# EAGLE design STM32F4 TFT-Proto Adapter FSMC (EAGLE 6.4)
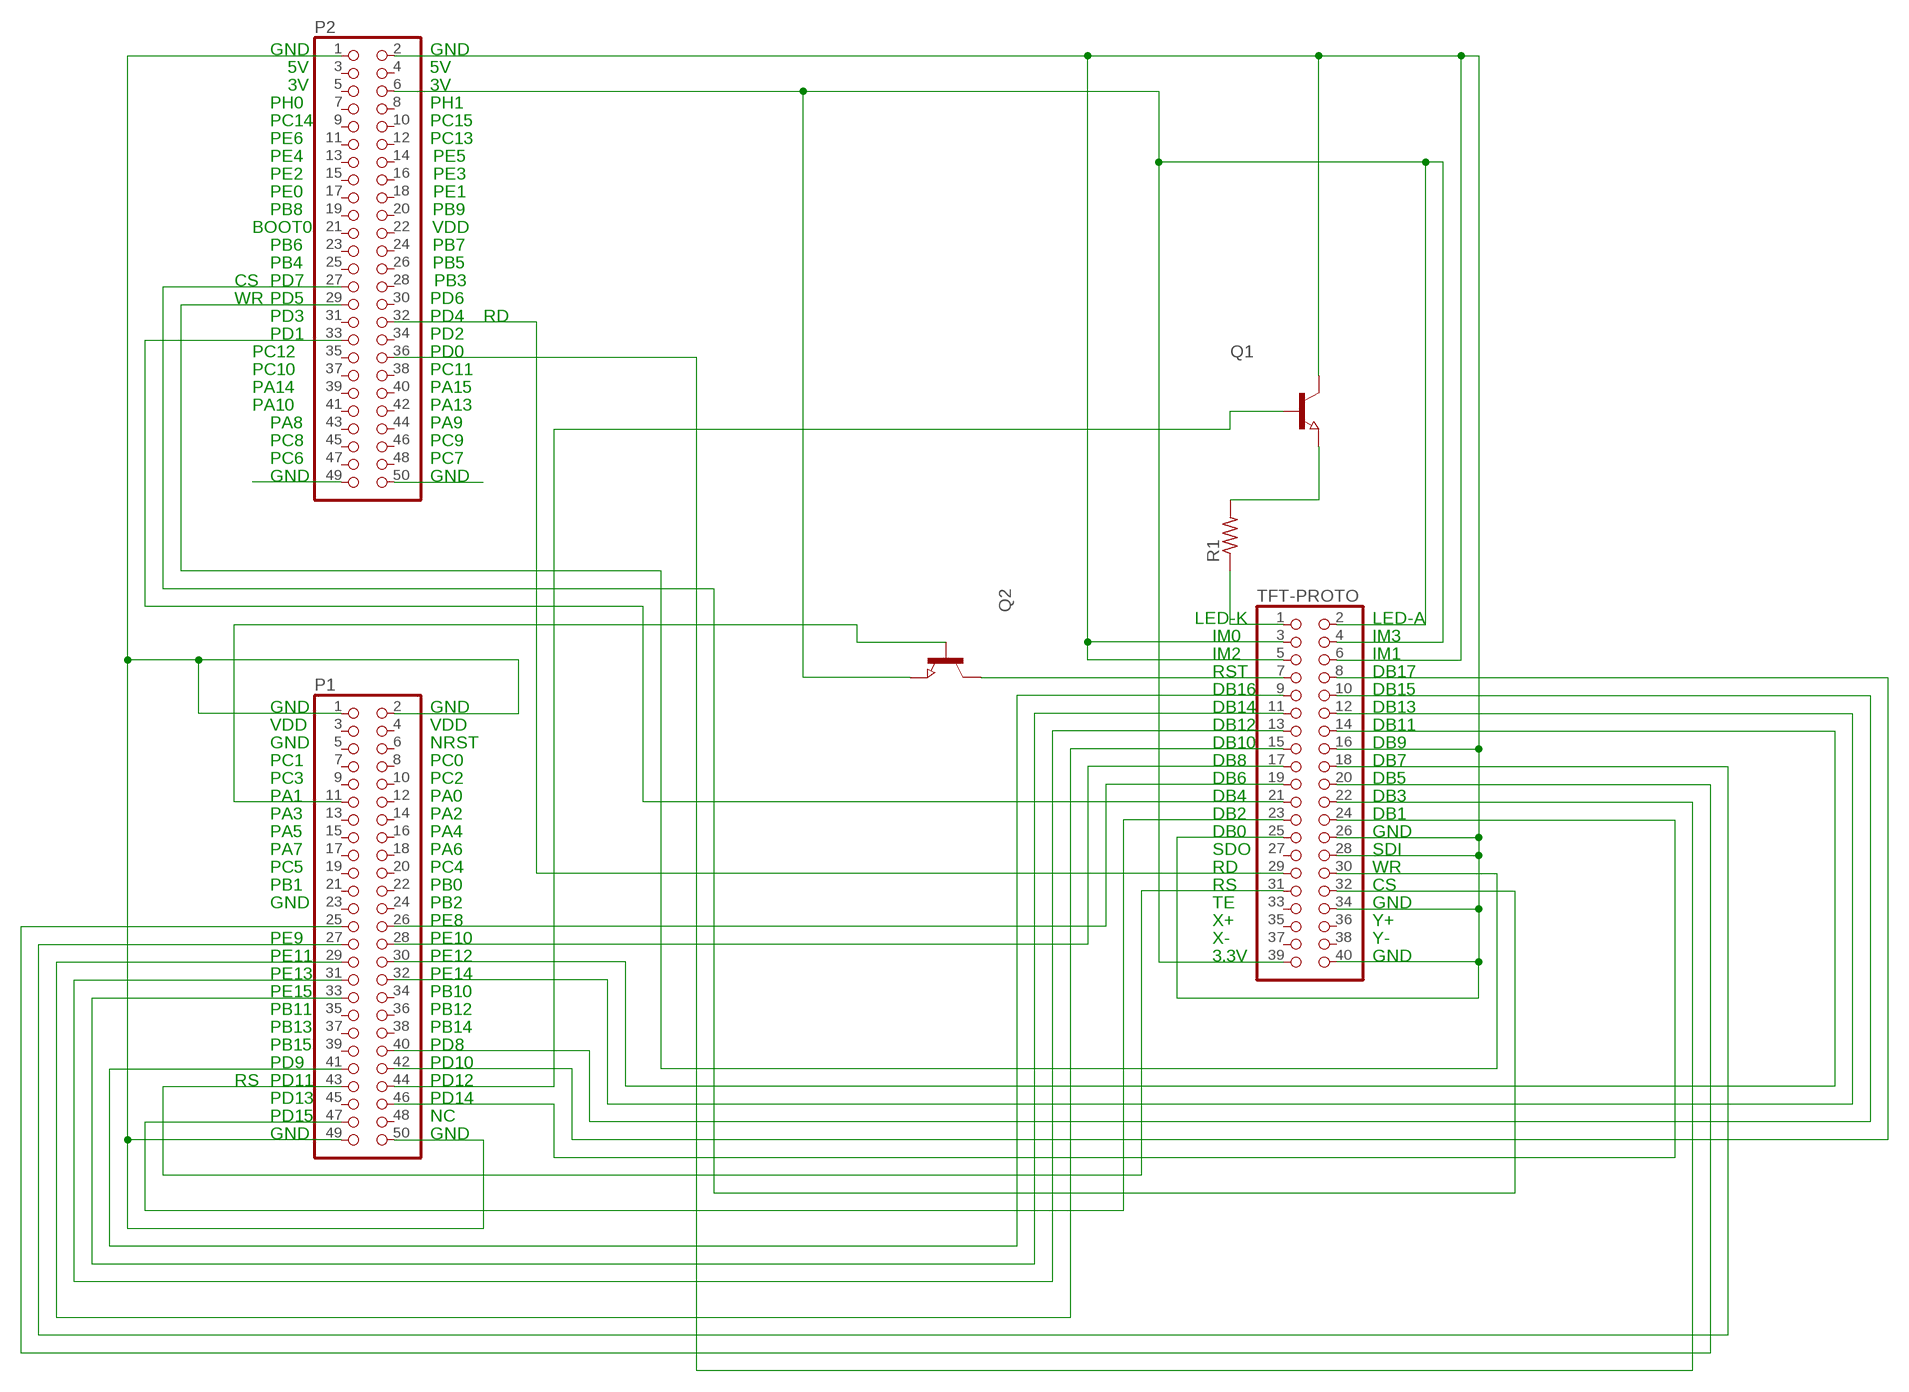
[diagram p0: schematic, sheet 1]

## Parts
P1  PINHD-2X25  [2X25]
P2  PINHD-2X25  [2X25]
Q1  NPN-TRANSISTOR_SOT23  [SOT23]
Q2  NPN-TRANSISTOR_SOT23  [SOT23]
R1  R-US_R0805  [R0805]
TFT-PROTO  PINHD-2X20  [2X20]

## Nets
CS: P2.27 TFT-PROTO.32
DB1: P1.46 TFT-PROTO.24
DB2: P1.47 TFT-PROTO.23
DB3: P2.36 TFT-PROTO.22
DB4: P2.33 TFT-PROTO.21
DB5: P1.25 TFT-PROTO.20
DB6: P1.26 TFT-PROTO.19
DB7: P1.27 TFT-PROTO.18
DB8: P1.28 TFT-PROTO.17
DB10: P1.29 TFT-PROTO.15
DB11: P1.30 TFT-PROTO.14
DB12: P1.31 TFT-PROTO.13
DB13: P1.32 TFT-PROTO.12
DB14: P1.33 TFT-PROTO.11
DB15: P1.40 TFT-PROTO.10
DB16: P1.41 TFT-PROTO.9
DB17: P1.42 TFT-PROTO.8
GND: P1.1 P1.2 P1.49 P1.50 P2.1 P2.2 P2.49 P2.50 Q1.3(C) TFT-PROTO.3 TFT-PROTO.5 TFT-PROTO.6 TFT-PROTO.16 TFT-PROTO.25 TFT-PROTO.26 TFT-PROTO.28 TFT-PROTO.34 TFT-PROTO.40
N$1: P1.44 Q1.1(B)
N$2: Q1.2(E) R1.2
N$3: R1.1 TFT-PROTO.1
N$4: Q2.3(C) TFT-PROTO.7
PWR: P2.6 Q2.2(E) TFT-PROTO.2 TFT-PROTO.4 TFT-PROTO.39
RD: P2.32 TFT-PROTO.29
RS: P1.43 TFT-PROTO.31
RST: P1.11 Q2.1(B)
WR: P2.29 TFT-PROTO.30
Unconnected: P1.3 P1.4 P1.5 P1.6 P1.7 P1.8 P1.9 P1.10 P1.12 P1.13 P1.14 P1.15 P1.16 P1.17 P1.18 P1.19 P1.20 P1.21 P1.22 P1.23 P1.24 P1.34 P1.35 P1.36 P1.37 P1.38 P1.39 P1.45 P1.48 P2.3 P2.4 P2.5 P2.7 P2.8 P2.9 P2.10 P2.11 P2.12 P2.13 P2.14 P2.15 P2.16 P2.17 P2.18 P2.19 P2.20 P2.21 P2.22 P2.23 P2.24 P2.25 P2.26 P2.28 P2.30 P2.31 P2.34 P2.35 P2.37 P2.38 P2.39 P2.40 P2.41 P2.42 P2.43 P2.44 P2.45 P2.46 P2.47 P2.48 TFT-PROTO.27 TFT-PROTO.33 TFT-PROTO.35 TFT-PROTO.36 TFT-PROTO.37 TFT-PROTO.38

## Notes on the sheet
- GND | GND
- 5V | 5V
- 3V | 3V
- PH0 | PH1
- PC14 | PC15
- PE6 | PC13
- PE4                          PE5
- PE2                          PE3
- PE0                          PE1
- PB8                          PB9
- BOOT0                        VDD
- PB6                          PB7
- PB4                          PB5
- CS | PD7                          PB3
- WR | PD5 | PD6
- PD3 | PD4 | RD
- PD1 | PD2
- PC12 | PD0
- PC10 | PC11
- PA14 | PA15
- PA10 | PA13
- PA8 | PA9
- PC8 | PC9
- PC6 | PC7
- GND | GND
- LED-K | LED-A
- IM0 | IM3
- IM2 | IM1
- RST | DB17
- DB16 | DB15
- GND | GND | DB14 | DB13
- VDD | VDD | DB12 | DB11
- GND | NRST | DB10 | DB9
- PC1 | PC0 | DB8 | DB7
- PC3 | PC2 | DB6 | DB5
- PA1 | PA0 | DB4 | DB3
- PA3 | PA2 | DB2 | DB1
- PA5 | PA4 | DB0 | GND
- PA7 | PA6 | SDO | SDI
- PC5 | PC4 | RD | WR
- PB1 | PB0 | RS | CS
- GND | PB2 | TE | GND
- PE7 | PE8 | X+ | Y+
- PE9 | PE10 | X- | Y-
- PE11 | PE12 | 3.3V | GND
- PE13 | PE14
- PE15 | PB10
- PB11 | PB12
- PB13 | PB14
- PB15 | PD8
- PD9 | PD10
- RS | PD11 | PD12
- PD13 | PD14
- PD15 | NC
- GND | GND

## Library data of the parts
P1 P2 = pinhead:PINHD-2X25: PIN HEADER
Q1 Q2 = semicon-smd-ipc:NPN-TRANSISTOR_: NPN TRANSISTOR
R1 = resistor:R-US_: RESISTOR, American symbol
TFT-PROTO = pinhead:PINHD-2X20: PIN HEADER

## Board
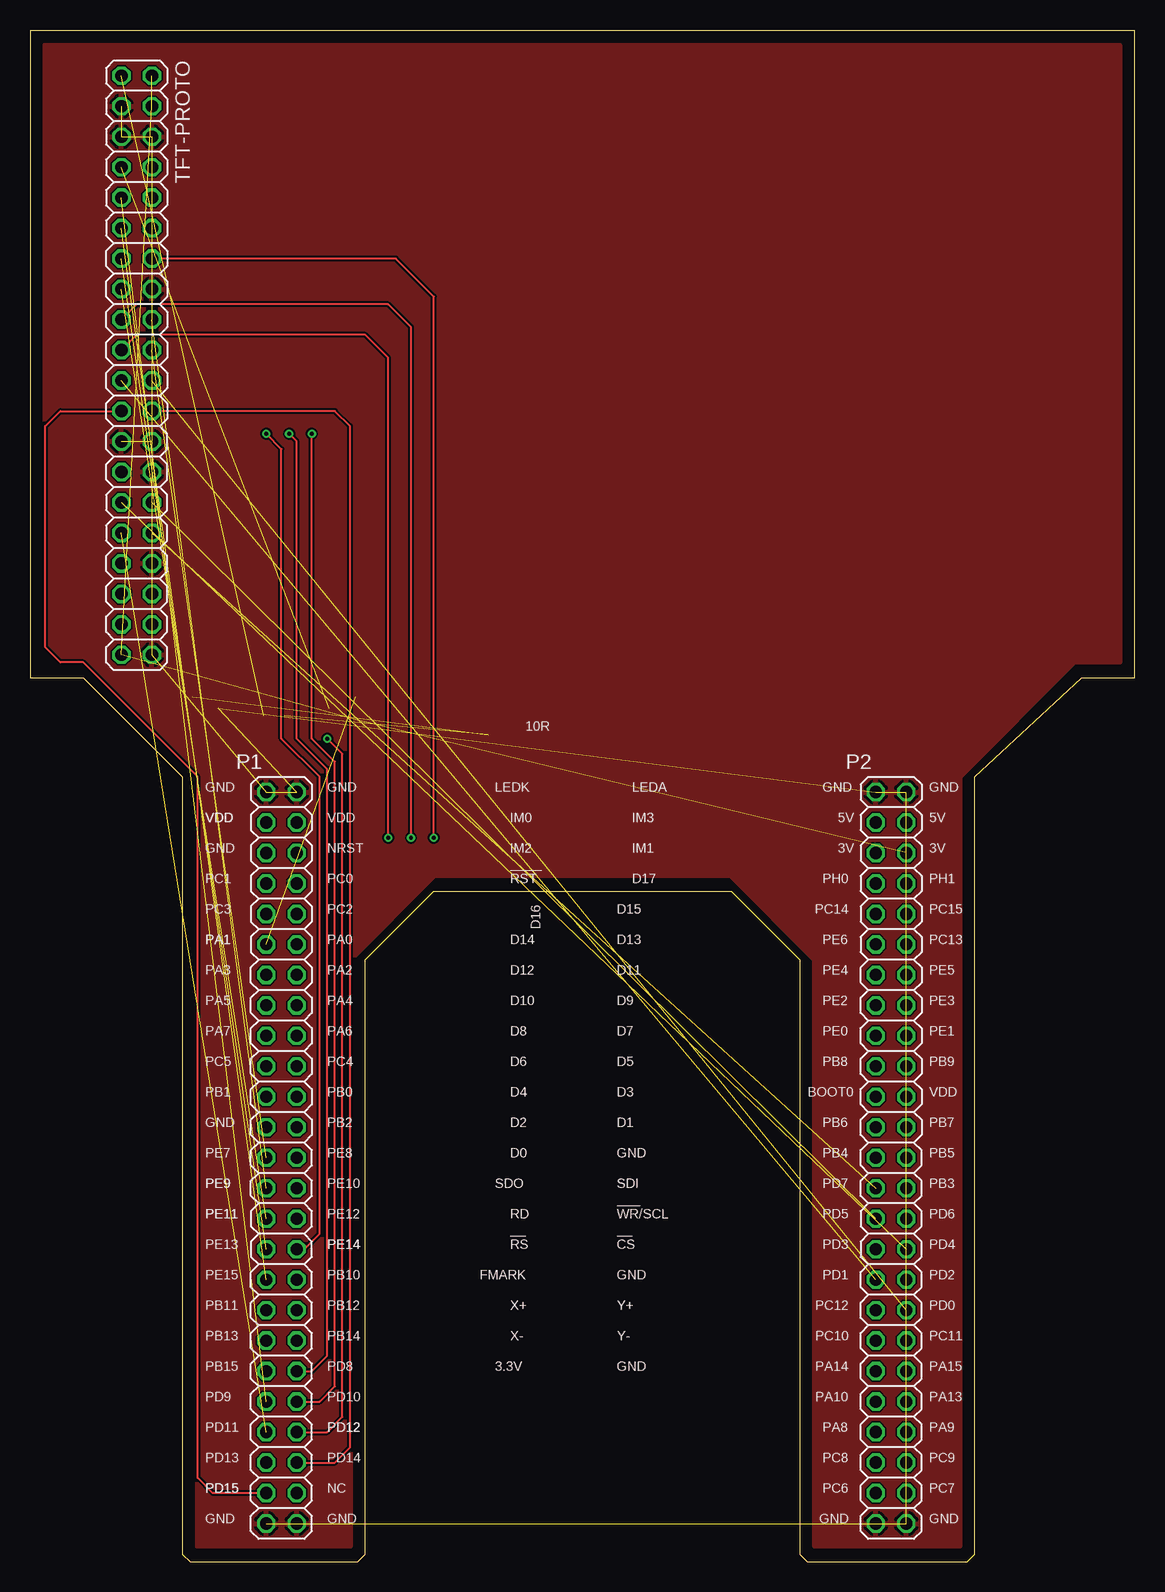
[diagram p1: board, top side]
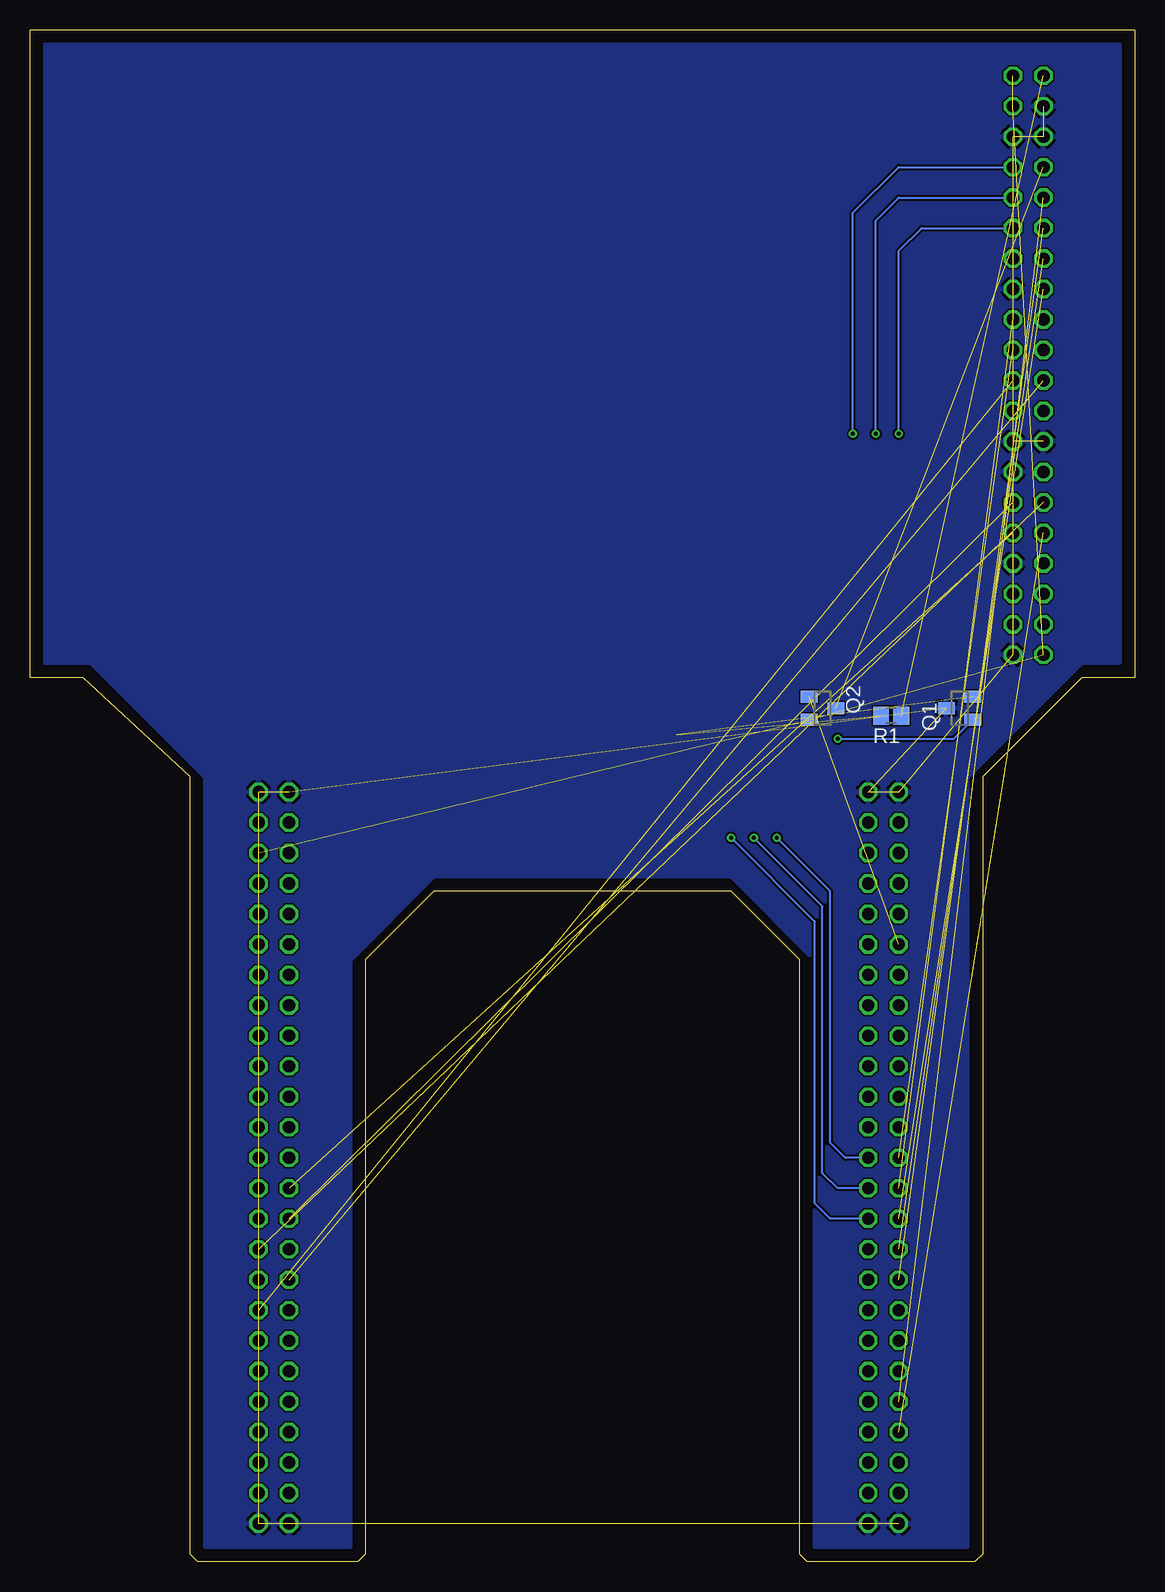
[diagram p2: board, bottom side, seen from below]

Size 92.08 x 127.64 mm. Coordinates in mm from the lower left corner, seen from the top.
Outline: 0,127.64 92.08,127.64 92.08,73.66 87.63,73.66 78.74,65.41 78.74,0.64 78.11,0 64.77,0 64.14,0.64 64.14,50.16 58.42,55.88 33.66,55.88 27.94,50.16 27.94,0.64 27.3,0 13.33,0 12.7,0.64 12.7,65.41 4.45,73.66 0,73.66 0,127.64
Copper layers (1*16): Top 0.0356mm / dielectric 1.5011mm / Bottom 0.0356mm
Design rules "LaenPCBOrder *": minimum track width 6mil, minimum drill 13mil, track to track 6mil, track to pad 6mil, pad to pad 6mil, via to via 6mil, smd to smd 6mil, copper to edge 15mil, drill to drill 6mil, minimum pad ring 7mil, minimum via ring 7mil, stop-mask expansion 4mil, vias tented up to drill 25mil, thermal gap 10mil

### Footprints (pad centres in the part's own frame; a part is rotated, then mirrored left to right if it is on the bottom)
2X25 = drill 1.016 octagon: 1 -30.48,-1.27; 2 -30.48,1.27; 3 -27.94,-1.27; 4 -27.94,1.27; 5 -25.4,-1.27; 6 -25.4,1.27; 7 -22.86,-1.27; 8 -22.86,1.27; 9 -20.32,-1.27; 10 -20.32,1.27; 11 -17.78,-1.27; 12 -17.78,1.27; 13 -15.24,-1.27; 14 -15.24,1.27; 15 -12.7,-1.27; 16 -12.7,1.27; 17 -10.16,-1.27; 18 -10.16,1.27; 19 -7.62,-1.27; 20 -7.62,1.27; 21 -5.08,-1.27; 22 -5.08,1.27; 23 -2.54,-1.27; 24 -2.54,1.27; 25 0,-1.27; 26 0,1.27; 27 2.54,-1.27; 28 2.54,1.27; 29 5.08,-1.27; 30 5.08,1.27; 31 7.62,-1.27; 32 7.62,1.27; 33 10.16,-1.27; 34 10.16,1.27; 35 12.7,-1.27; 36 12.7,1.27; 37 15.24,-1.27; 38 15.24,1.27; 39 17.78,-1.27; 40 17.78,1.27; 41 20.32,-1.27; 42 20.32,1.27; 43 22.86,-1.27; 44 22.86,1.27; 45 25.4,-1.27; 46 25.4,1.27; 47 27.94,-1.27; 48 27.94,1.27; 49 30.48,-1.27; 50 30.48,1.27
SOT23 = smd 1 x 1.4: 1 -0.95,-1.1; 2 0.95,-1.1; 3 0,1.1
R0805 = smd 1.3 x 1.5: 1 -0.85,0; 2 0.85,0
2X20 = drill 1.016 octagon: 1 -24.13,-1.27; 2 -24.13,1.27; 3 -21.59,-1.27; 4 -21.59,1.27; 5 -19.05,-1.27; 6 -19.05,1.27; 7 -16.51,-1.27; 8 -16.51,1.27; 9 -13.97,-1.27; 10 -13.97,1.27; 11 -11.43,-1.27; 12 -11.43,1.27; 13 -8.89,-1.27; 14 -8.89,1.27; 15 -6.35,-1.27; 16 -6.35,1.27; 17 -3.81,-1.27; 18 -3.81,1.27; 19 -1.27,-1.27; 20 -1.27,1.27; 21 1.27,-1.27; 22 1.27,1.27; 23 3.81,-1.27; 24 3.81,1.27; 25 6.35,-1.27; 26 6.35,1.27; 27 8.89,-1.27; 28 8.89,1.27; 29 11.43,-1.27; 30 11.43,1.27; 31 13.97,-1.27; 32 13.97,1.27; 33 16.51,-1.27; 34 16.51,1.27; 35 19.05,-1.27; 36 19.05,1.27; 37 21.59,-1.27; 38 21.59,1.27; 39 24.13,-1.27; 40 24.13,1.27

### Placement (x,y rotation side)
P1  20.95,33.66 270 top
P2  71.75,33.66 270 top
Q1  14.61,71.12 90 bottom
Q2  26.04,71.12 270 bottom
R1  20.32,70.48 180 bottom
TFT-PROTO  8.89,99.7 270 top

### Tracks (layer width: path | path; a pad name or v marks a point on that pad's centre or on a via)
CS  (1 unrouted)
DB1
  Top 0.178: P1.46 25.4,8.26 26.67,9.53 26.67,94.62 25.4,95.89 TFT-PROTO.24
DB2
  Top 0.178: P1.47 15.24,5.71 13.97,6.98 13.97,65.41 4.45,74.93 2.54,74.93 1.27,76.2 1.27,94.62 2.54,95.89 TFT-PROTO.23
DB3  (1 unrouted)
DB4  (1 unrouted)
DB5  (1 unrouted)
DB6  (via drill 0.33)
  Top 0.178: v29.84,60.32 29.84,100.33 27.94,102.23 8.89,102.23 TFT-PROTO.19
  Bottom 0.178: P1.26 24.13,33.66 25.4,34.92 25.4,55.88 v29.84,60.32
DB7  (1 unrouted)
DB8  (via drill 0.33)
  Top 0.178: v31.75,60.32 31.75,102.87 29.84,104.78 8.89,104.78 TFT-PROTO.17
  Bottom 0.178: P1.28 24.77,31.12 26.04,32.38 26.04,54.61 v31.75,60.32
DB10  (1 unrouted)
DB11  (via drill 0.33)
  Top 0.178: v33.66,60.32 33.66,105.41 30.48,108.59 TFT-PROTO.14
  Bottom 0.178: P1.30 25.4,28.58 26.67,29.85 26.67,53.34 v33.66,60.32
DB12  (1 unrouted)
DB13  (via drill 0.33)
  Top 0.178: P1.32 22.86,26.04 24.13,27.31 24.13,65.41 20.95,68.58 20.95,92.71 v19.68,93.98
  Bottom 0.178: v19.68,93.98 19.68,109.22 17.78,111.12 TFT-PROTO.12
DB14  (1 unrouted)
DB15  (via drill 0.33)
  Top 0.178: P1.40 23.49,15.88 24.77,17.15 24.77,66.04 22.23,68.58 22.23,93.34 v21.59,93.98
  Bottom 0.178: v21.59,93.98 21.59,111.76 19.68,113.67 TFT-PROTO.10
DB16  (1 unrouted)
DB17  (via drill 0.33)
  Top 0.178: P1.42 24.13,13.33 25.4,14.61 25.4,66.68 23.49,68.58 v23.49,93.98
  Bottom 0.178: v23.49,93.98 23.49,112.4 19.68,116.2 TFT-PROTO.8
GND  (17 unrouted)
  pour Top: 1.27,126.37 90.8,126.37 90.8,74.93 86.99,74.93 77.47,65.41 77.47,1.27 65.41,1.27 65.41,50.16 58.42,57.15 33.66,57.15 26.67,50.16 26.67,1.27 13.97,1.27 13.97,65.41 4.45,74.93 1.27,74.93
  pour Bottom: 1.27,126.37 90.8,126.37 90.8,74.93 86.99,74.93 77.47,65.41 77.47,1.27 65.41,1.27 65.41,50.16 58.42,57.15 33.66,57.15 26.67,50.16 26.67,1.27 13.97,1.27 13.97,65.41 4.45,74.93 1.27,74.93
N$1  (via drill 0.33)
  Top 0.178: P1.44 24.77,10.79 26.04,12.06 26.04,67.31 v24.77,68.58
  Bottom 0.178: v24.77,68.58 15.09,68.58 Q1.1
N$2  (2 unrouted)
N$3  (1 unrouted)
N$4  (1 unrouted)
PWR  (4 unrouted)
RD  (1 unrouted)
RS  (1 unrouted)
RST  (1 unrouted)
WR  (1 unrouted)

### Text on the board
tPlace: GND
tNames: 10R | GND | GND | LEDK | LEDA | GND | GND | VDD | VDD | VDD | IM0 | IM3 | 5V | 5V | GND | NRST | IM2 | IM1 | 3V | 3V | ____ | PC1 | PC0 | RST | D17 | PH0 | PH1 | PC3 | PC2 | D15 | PC14 | PC15 | D16 | PA1 | PA1 | PA0 | D14 | D13 | PE6 | PC13 | PA3 | PA2 | D12 | D11 | PE4 | PE5 | PA5 | PA4 | D10 | D9 | PE2 | PE3 | PA7 | PA6 | D8 | D7 | PE0 | PE1 | PC5 | PC4 | D6 | D5 | PB8 | PB9 | PB1 | PB0 | D4 | D3 | BOOT0 | VDD | GND | PB2 | D2 | D1 | PB6 | PB7 | PE7 | PE8 | D0 | GND | PB4 | PB5 | PE9 | PE9 | PE10 | SDO | SDI | PD7 | PB3 | ___ | PE11 | PE11 | PE12 | RD | WR/SCL | PD5 | PD6 | __ | __ | PE13 | PE14 | PE14 | RS | CS | PD3 | PD4 | PE15 | PB10 | FMARK | GND | PD1 | PD2 | PB11 | PB12 | X+ | Y+ | PC12 | PD0 | PB13 | PB14 | X- | Y- | PC10 | PC11 | PB15 | PD8 | 3.3V | PA14 | PA15 | PD9 | PD10 | PA10 | PA13 | PD11 | PD12 | PD12 | PA8 | PA9 | PD13 | PD14 | PC8 | PC9 | PD15 | PD15 | NC | PC6 | PC7 | GND | GND | GND | GND